# EAGLE design PCF8583 1v3 (EAGLE 6.6.0)
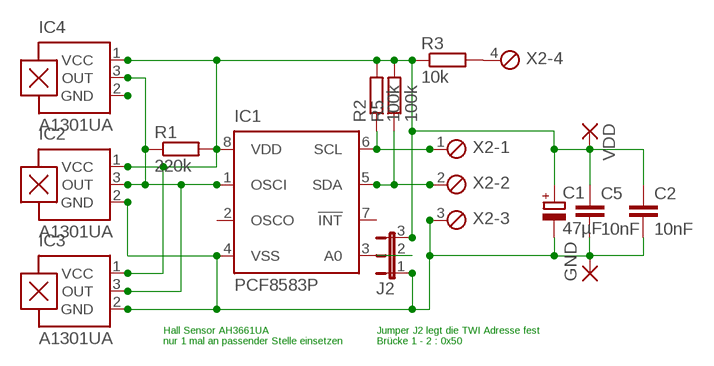
[diagram p0: schematic, sheet 1]

## Parts
C1  47µF  CPOL-EUE2.5-5  [E2,5-5]
C2  10nF  C-EU025-024X044  [C025-024X044]
C5  10nF  C-EU025-024X044  [C025-024X044]
GND  2,54/1,0  [2,54/1,0]
IC1  PCF8583P  [DIL08]
IC2  A1301UA  [SIP3-UA]
IC3  A1301UA  [SIP3-UA]
IC4  A1301UA  [SIP3-UA]
J2  JP2E  [JP2]
R1  220k  R-EU_0204/7  [0204/7]
R2  100k  R-EU_0204/7  [0204/7]
R3  10k  R-EU_0204/7  [0204/7]
R5  100k  R-EU_0204/7  [0204/7]
VDD  2,54/1,0  [2,54/1,0]
X2  MPT4  [4POL254]

## Nets
CNT: IC1.1(OSCI) IC2.3(OUT) IC3.3(OUT) IC4.3(OUT) R1.1
GND: C1.- C2.2 C5.2 GND.1(P) IC1.4(VSS) IC2.2(GND) IC3.2(GND) IC4.2(GND) J2.1 X2.3
N$1: R3.2 X2.4
N$2: IC1.3(A0) J2.2
SCL: IC1.6(SCL) R2.1 X2.1
SDA: IC1.5(SDA) R5.1 X2.2
VDD: C1.+ C2.1 C5.1 IC1.8(VDD) IC2.1(VCC) IC3.1(VCC) IC4.1(VCC) J2.3 R1.2 R2.2 R3.1 R5.2 VDD.1(P)
Unconnected: IC1.2(OSCO) IC1.7(!INT)

## Notes on the sheet
- Hall Sensor AH3661UA
  nur 1 mal an passender Stelle einsetzen
- Jumper J2 legt die TWI Adresse fest
  Brücke 1 - 2 : 0x50

## Library data of the parts
C1 = resistor:CPOL-EU: POLARIZED CAPACITOR, European symbol
C2 C5 = resistor:C-EU: CAPACITOR, European symbol
GND VDD = wirepad:2,54/1,0: THROUGH-HOLE PAD
IC1 = ds1307_pcf8583:PCF8583: I2C-Bus CLOCK/CALENDAR
IC2-IC4 = allegro:A13*?: Linear Hall Effect Sensor ICs Continuous-Time Ratiometric High-Temperature Operation Programmable Linear with Analog Output A1302 -Replacement- UGN3503 Source: http://www.allegromicro.com/en/Products/Part_Numbers/1301/1301.pdf http://www.allegromicro.com/en/Products/Part_Numbers/1321/1321.pdf http://www.allegromicro.com/en/Products/Part_Numbers/1381/1381.pdf; MF: ALLEGRO MICROSYSTEMS, INC.; MPN: A1301EUA-T; OC_FARNELL: 1198085; OC_NEWARK: 31K6635
J2 = jumper:JP2E: JUMPER
R1-R3 R5 = resistor:R-EU_: RESISTOR, European symbol
X2 = con-phoenix-254:MPT4: PHOENIX CONNECTOR; OC_FARNELL: unknown; OC_NEWARK: unknown

## Board
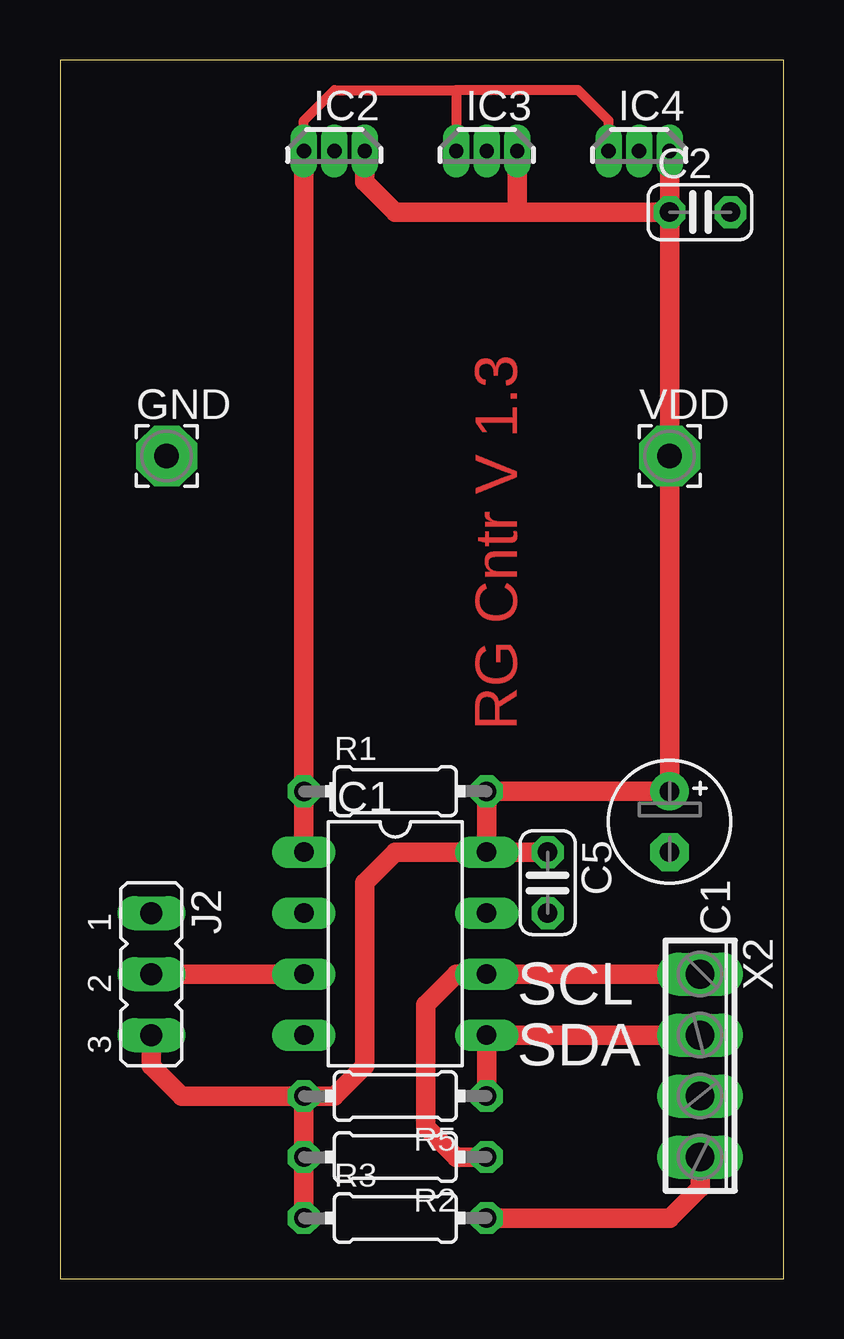
[diagram p1: board, top side]
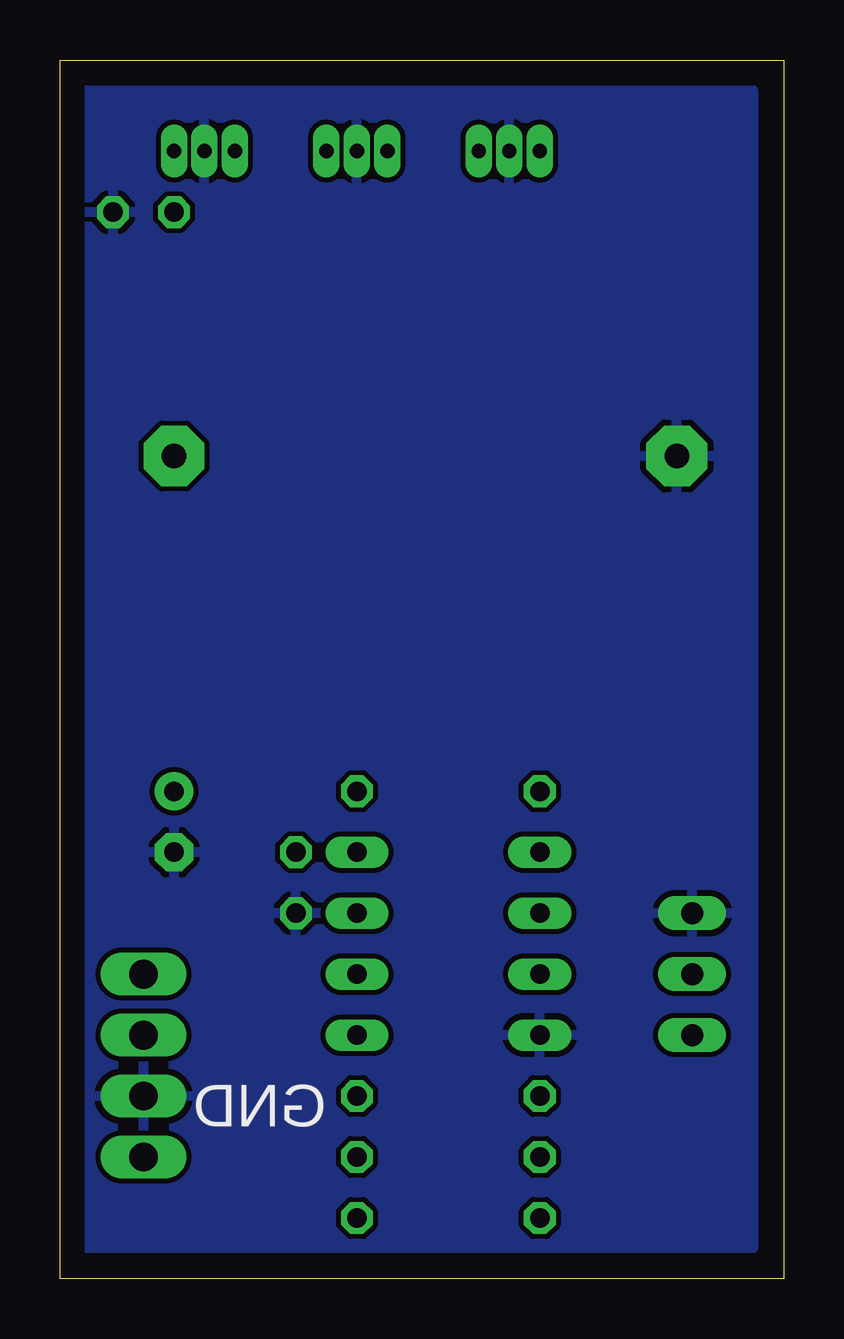
[diagram p2: board, bottom side, seen from below]

Size 30.15 x 50.79 mm. Coordinates in mm from the lower left corner, seen from the top.
Outline: 0,0 30.15,0 30.15,50.79 0,50.79 0,0
Copper layers (1*16): Top 0.035mm / dielectric 1.5mm / Bottom 0.035mm
Design rules "default": minimum track width 10mil, minimum drill 24mil, track to track 8mil, track to pad 8mil, pad to pad 8mil, via to via 8mil, smd to smd 8mil, copper to edge 40mil, drill to drill 8mil, minimum pad ring 10mil, minimum via ring 8mil, stop-mask expansion 4mil, vias tented up to drill 0mil, thermal gap 10mil

### Footprints (pad centres in the part's own frame; a part is rotated, then mirrored left to right if it is on the bottom)
E2,5-5 = drill 0.813 pad 1.6: + -1.27,0 | drill 0.813 pad 1.6 octagon: - 1.27,0
C025-024X044 = drill 0.813 octagon: 1 -1.27,0; 2 1.27,0
2,54/1,0 = drill 1.016 pad 2.54 octagon: 1 0,0
DIL08 = drill 0.813 long: 1 -3.81,-3.81; 2 -1.27,-3.81; 3 1.27,-3.81; 4 3.81,-3.81; 5 3.81,3.81; 6 1.27,3.81; 7 -1.27,3.81; 8 -3.81,3.81
SIP3-UA = drill 0.6 pad 0.7 long: 1 -1.27,0; 2 0,0; 3 1.27,0
JP2 = drill 0.914 long: 1 -2.54,0; 2 0,0; 3 2.54,0
0204/7 = drill 0.813 octagon: 1 -3.81,0; 2 3.81,0
4POL254 = drill 1.2 long: 1 -3.81,0; 2 -1.27,0; 3 1.27,0; 4 3.81,0

### Placement (x,y rotation side)
C1  25.4,19.05 270 top
C2  26.67,44.45 0 top
C5  20.32,16.51 270 top
GND  4.45,34.29 0 top
IC1  13.97,13.97 270 top
IC2  11.43,46.99 180 top
IC3  17.78,46.99 180 top
IC4  24.13,46.99 180 top
J2  3.81,12.7 270 top
R1  470k  [0204/7]  13.97,20.32 0 top
R2  220k  [0204/7]  13.97,5.08 180 top
R3  13.97,2.54 0 top
R5  220k  [0204/7]  13.97,7.62 180 top
VDD  25.4,34.29 0 top
X2  26.67,8.89 270 top

### Tracks (layer width: path | path; a pad name or v marks a point on that pad's centre or on a via)
CNT
  Top 0.406: IC4.3 22.86,48.26 21.59,49.53 16.51,49.53 | 16.51,49.53 IC3.3 | IC2.3 10.16,48.26 11.43,49.53 16.51,49.53
  Top 0.813: IC2.3 R1.1 IC1.1
GND
  pour Bottom: 1.27,49.53 1.27,1.27 29.21,1.27 29.21,49.53
N$1
  Top 0.813: R3.2 25.4,2.54 26.67,3.81 X2.4
N$2
  Top 0.813: IC1.3 J2.2
SCL
  Top 0.813: R2.1 16.51,5.08 15.24,6.35 15.24,11.43 16.51,12.7 IC1.6 X2.1
SDA
  Top 0.813: R5.1 IC1.5 X2.2
VDD
  Top 0.813: R5.2 R2.2 R3.1 | J2.3 3.81,8.89 5.08,7.62 R5.2 | IC1.8 13.97,17.78 12.7,16.51 12.7,8.89 11.43,7.62 R5.2 | IC1.8 R1.2 C1.+ VDD.1 C2.1 | IC1.8 C5.1 | IC4.1 C2.1 | IC2.1 12.7,45.72 13.97,44.45 19.05,44.45 | IC3.1 19.05,44.45 | 19.05,44.45 C2.1

### Text on the board
Top: RG Cntr V 1.3
tNames: SCL | SDA
bNames: GND